# EAGLE design ble_bme690_node (EAGLE 9.6.2)

## Sheet 1 of 2
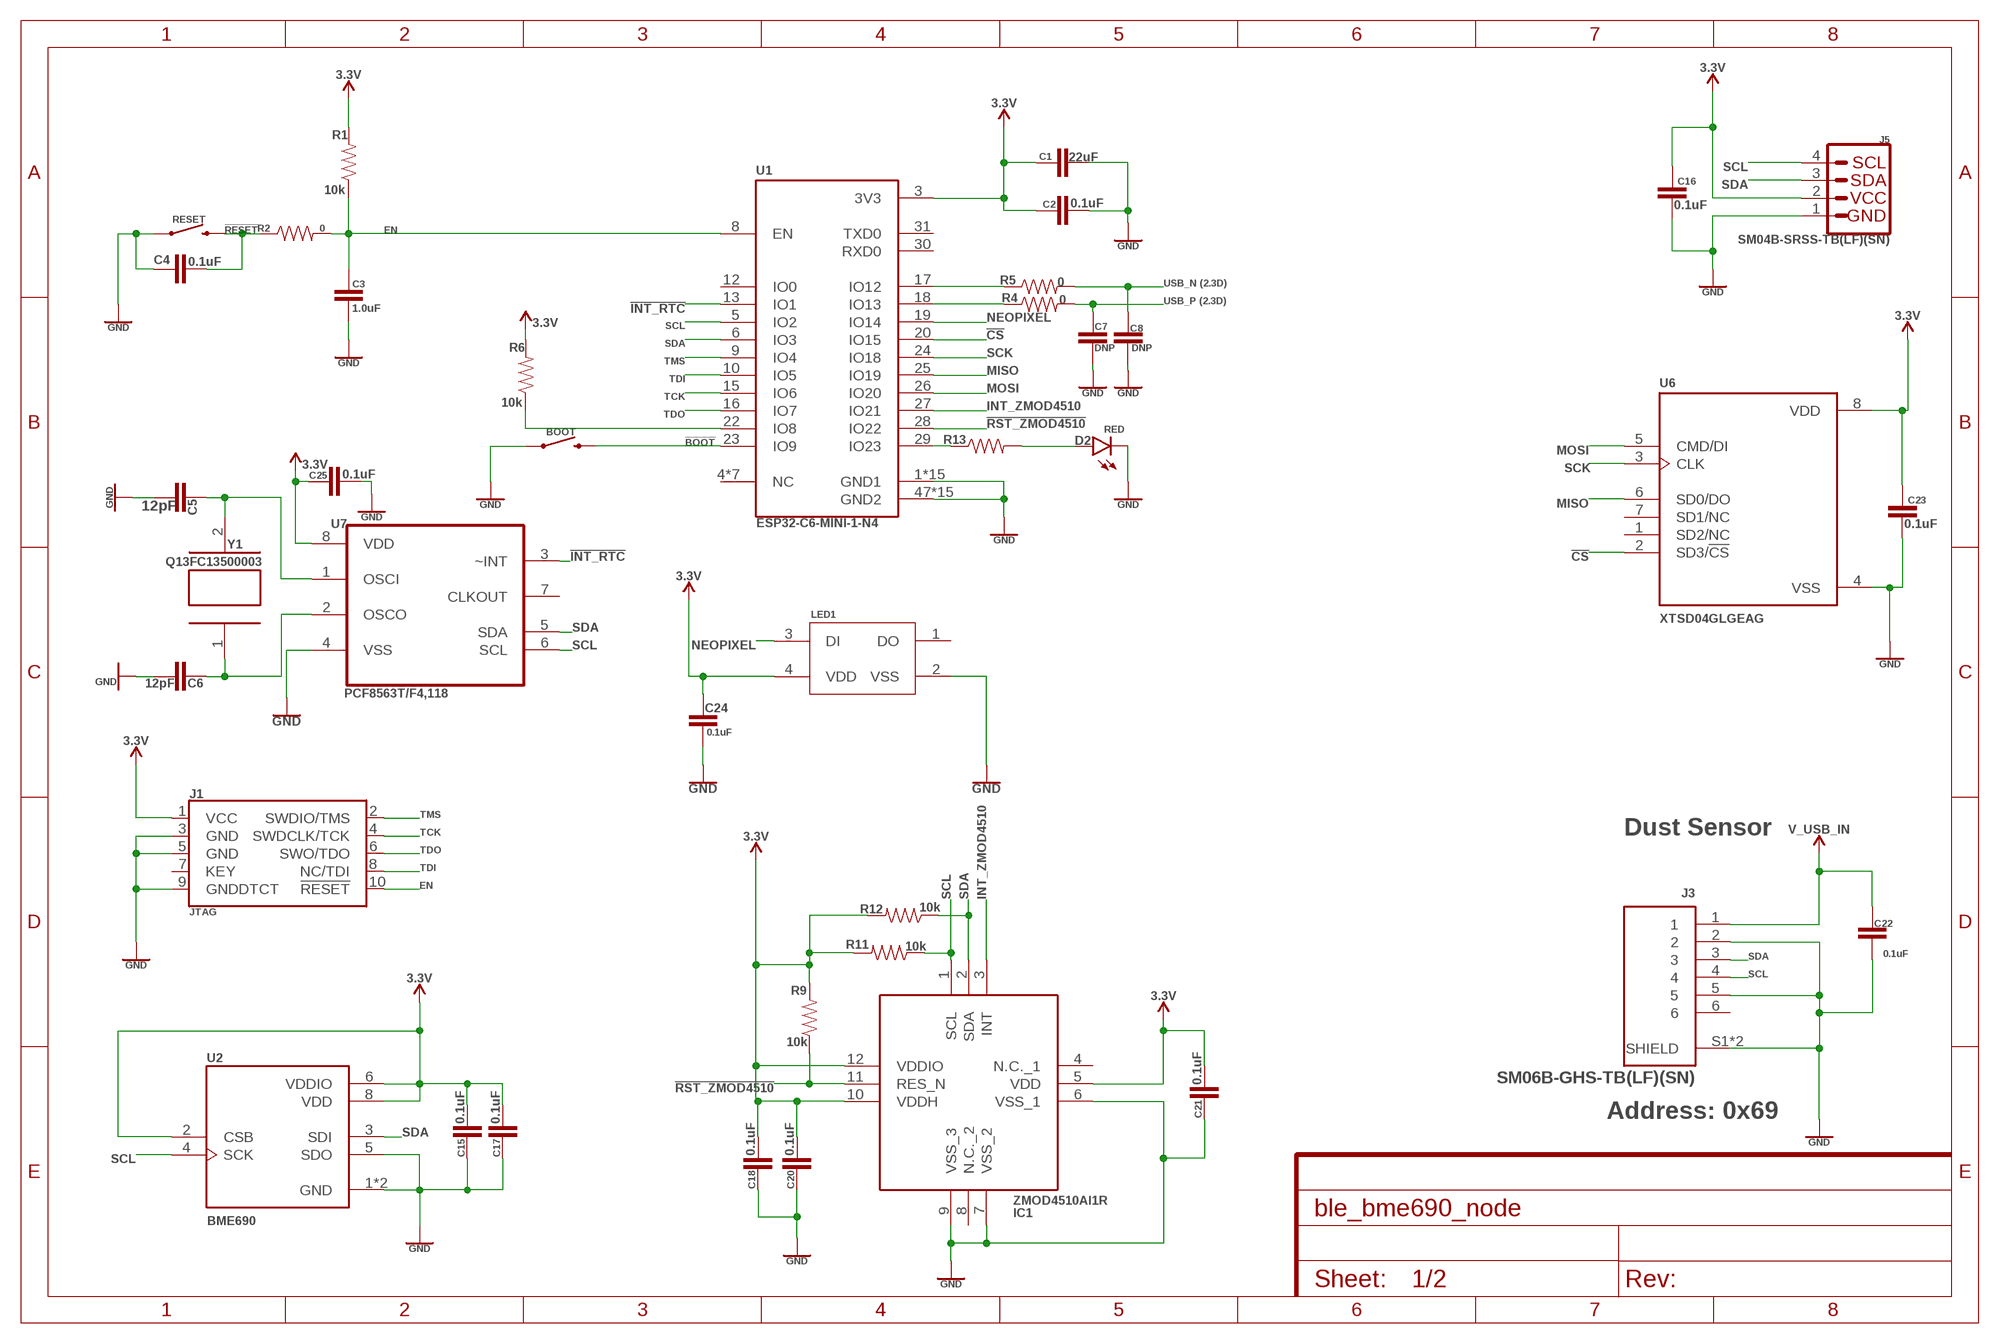
[diagram p0: schematic, sheet 1]

### Parts
BOOT  MOMENTARY-SWITCH-SPST-SMD-4.6X2.8MM  [TACTILE_SWITCH_SMD_4.6X2.8MM]
C1  22uF  22UF-0603-6.3V-20%  [0603]
C2  0.1uF  0.1UF-0402-6.3V-10%-X7R  [0402]
C3  1.0uF  1.0UF-0402-16V-10%  [0402]
C4  0.1uF  0.1UF-0402-6.3V-10%-X7R  [0402]
C5  12pF  12PF-0402-50V-5%  [0402]
C6  12pF  12PF-0402-50V-5%  [0402]
C7  DNP  0.1UF-0402-6.3V-10%-X7R  [0402]
C8  DNP  0.1UF-0402-6.3V-10%-X7R  [0402]
C15  0.1uF  0.1UF-0402-6.3V-10%-X7R  [0402]
C16  0.1uF  0.1UF-0402-6.3V-10%-X7R  [0402]
C17  0.1uF  0.1UF-0402-6.3V-10%-X7R  [0402]
C18  0.1uF  0.1UF-0402-6.3V-10%-X7R  [0402]
C20  0.1uF  0.1UF-0402-6.3V-10%-X7R  [0402]
C21  0.1uF  0.1UF-0402-6.3V-10%-X7R  [0402]
C22  0.1uF  0.1UF-0402-16V-10%  [0402]
C23  0.1uF  0.1UF-0402-6.3V-10%-X7R  [0402]
C24  0.1uF  0.1UF-0402-16V-10%  [0402]
C25  0.1uF  0.1UF-0402-6.3V-10%-X7R  [0402]
D2  RED  LED-RED0603  [LED-0603]
IC1  ZMOD4510AI1R  [ZMOD4510AI1R]
J1  JTAG  CORTEX_JTAG_DEBUG_SMD-UNSHROUDED  [2X5-SMD-UNSHROUDED]
J3  SM06B-GHS-TB(LF)(SN)  [JST_SM06B-GHS-TB(LF)(SN)]
J5  SM04B-SRSS-TB(LF)(SN)  QWIIC_CONNECTORJS-1MM  [1X04_1MM_RA]
LED1  WS2812B-2020  [WS2812B-2020]
R1  10k  10KOHM-0402-1/16W-1%  [0402]
R2  0  0OHM-0402-1/10W  [0402]
R4  0  0OHM-0402-1/10W  [0402]
R5  0  0OHM-0402-1/10W  [0402]
R6  10k  10KOHM-0402-1/16W-1%  [0402]
R9  10k  10KOHM-0402-1/16W-1%  [0402]
R11  10k  10KOHM-0402-1/16W-1%  [0402]
R12  10k  10KOHM-0402-1/16W-1%  [0402]
R13  100OHM  [0402]
RESET  MOMENTARY-SWITCH-SPST-SMD-4.6X2.8MM  [TACTILE_SWITCH_SMD_4.6X2.8MM]
U1  ESP32-C6-MINI-1-N4  [XCVR_ESP32-C6-MINI-1-N4]
U2  BME690  [IC_BME688]
U6  XTSD04GLGEAG  [SON127P600X800X95-8N]
U7  PCF8563T/F4,118  [SOIC127P600X175-8N]
Y1  Q13FC13500003  FC-135_32.7680KA-A0  [XTAL_FC-135_32.7680KA-A0]

### Nets
3.3V: C1.1 C2.1 C15.2 C16.2 C17.2 C18.2 C20.2 C21.2 C23.2 C24.1 C25.1 IC1.5(VDD) IC1.10(VDDH) IC1.12(VDDIO) J1.1(VCC) J5.2 LED1.4(VDD) R1.2 R6.2 R9.2 R11.2 R12.2 U1.3(3V3) U2.2(CSB) U2.6(VDDIO) U2.8(VDD) U6.8(VDD) U7.8(VDD) ; also sheet 2
!BOOT: BOOT.3 BOOT.4 U1.23(IO9)
!CS: U1.20(IO15) U6.2(SD3/!CS)
!INT_RTC: U1.13(IO1) U7.3(~INT)
!RESET: C4.2 R2.1 RESET.3 RESET.4
!RST_ZMOD4510: IC1.11(RES_N) R9.1 U1.28(IO22)
EN: C3.2 J1.10(!RESET) R1.1 R2.2 U1.8(EN)
GND: BOOT.1 BOOT.2 C1.2 C2.2 C3.1 C4.1 C5.2 C6.2 C7.2 C8.2 C15.1 C16.1 C17.1 C18.1 C20.1 C21.1 C22.2 C23.1 C24.2 C25.2 D2.C IC1.6(VSS_1) IC1.7(VSS_2) IC1.9(VSS_3) J1.3(GND) J1.5(GND) J1.9(GNDDTCT) J3.2 J3.5 J3.S1(SHIELD) J3.S2(SHIELD) J5.1 LED1.2(VSS) RESET.1 RESET.2 U1.1(GND1) U1.2(GND1) U1.11(GND1) U1.14(GND1) U1.36(GND1) U1.37(GND1) U1.38(GND1) U1.39(GND1) U1.40(GND1) U1.41(GND1) U1.42(GND1) U1.43(GND1) U1.44(GND1) U1.45(GND1) U1.46(GND1) U1.47(GND2) U1.48(GND2) U1.49_1(GND2) U1.49_2(GND2) U1.49_3(GND2) U1.49_4(GND2) U1.49_5(GND2) U1.49_6(GND2) U1.49_7(GND2) U1.49_8(GND2) U1.49_9(GND2) U1.50(GND2) U1.51(GND2) U1.52(GND2) U1.53(GND2) U2.1(GND) U2.5(SDO) U2.7(GND) U6.4(VSS) U7.4(VSS) ; also sheet 2
INT_ZMOD4510: IC1.3(INT) U1.27(IO21)
MISO: U1.25(IO19) U6.6(SD0/DO)
MOSI: U1.26(IO20) U6.5(CMD/DI)
N$1: R5.1 U1.17(IO12)
N$2: R4.1 U1.18(IO13)
N$3: R6.1 U1.22(IO8)
N$8: C5.1 U7.1(OSCI) Y1.2
N$11: R13.1 U1.29(IO23)
N$12: D2.A R13.2
NEOPIXEL: LED1.3(DI) U1.19(IO14)
RTC_IN: C6.1 U7.2(OSCO) Y1.1
SCK: U1.24(IO18) U6.3(CLK)
SCL: IC1.1(SCL) J3.4 J5.4 R11.1 U1.5(IO2) U2.4(SCK) U7.6(SCL)
SDA: IC1.2(SDA) J3.3 J5.3 R12.1 U1.6(IO3) U2.3(SDI) U7.5(SDA)
TCK: J1.4(SWDCLK/TCK) U1.15(IO6)
TDI: J1.8(NC/TDI) U1.10(IO5)
TDO: J1.6(SWO/TDO) U1.16(IO7)
TMS: J1.2(SWDIO/TMS) U1.9(IO4)
USB_N: C8.1 R5.2 ; also sheet 2
USB_P: C7.1 R4.2 ; also sheet 2
V_USB_2: C22.1 J3.1 ; supply symbol labelled V_USB_IN ; also sheet 2
Unconnected: IC1.4(N.C._1) IC1.8(N.C._2) J1.7(KEY) J3.6 LED1.1(DO) U1.4(NC) U1.7(NC) U1.12(IO0) U1.21(NC) U1.30(RXD0) U1.31(TXD0) U1.32(NC) U1.33(NC) U1.34(NC) U1.35(NC) U6.1(SD2/NC) U6.7(SD1/NC) U7.7(CLKOUT)

### Notes on the sheet
- Dust Sensor
- Address: 0x69

## Sheet 2 of 2
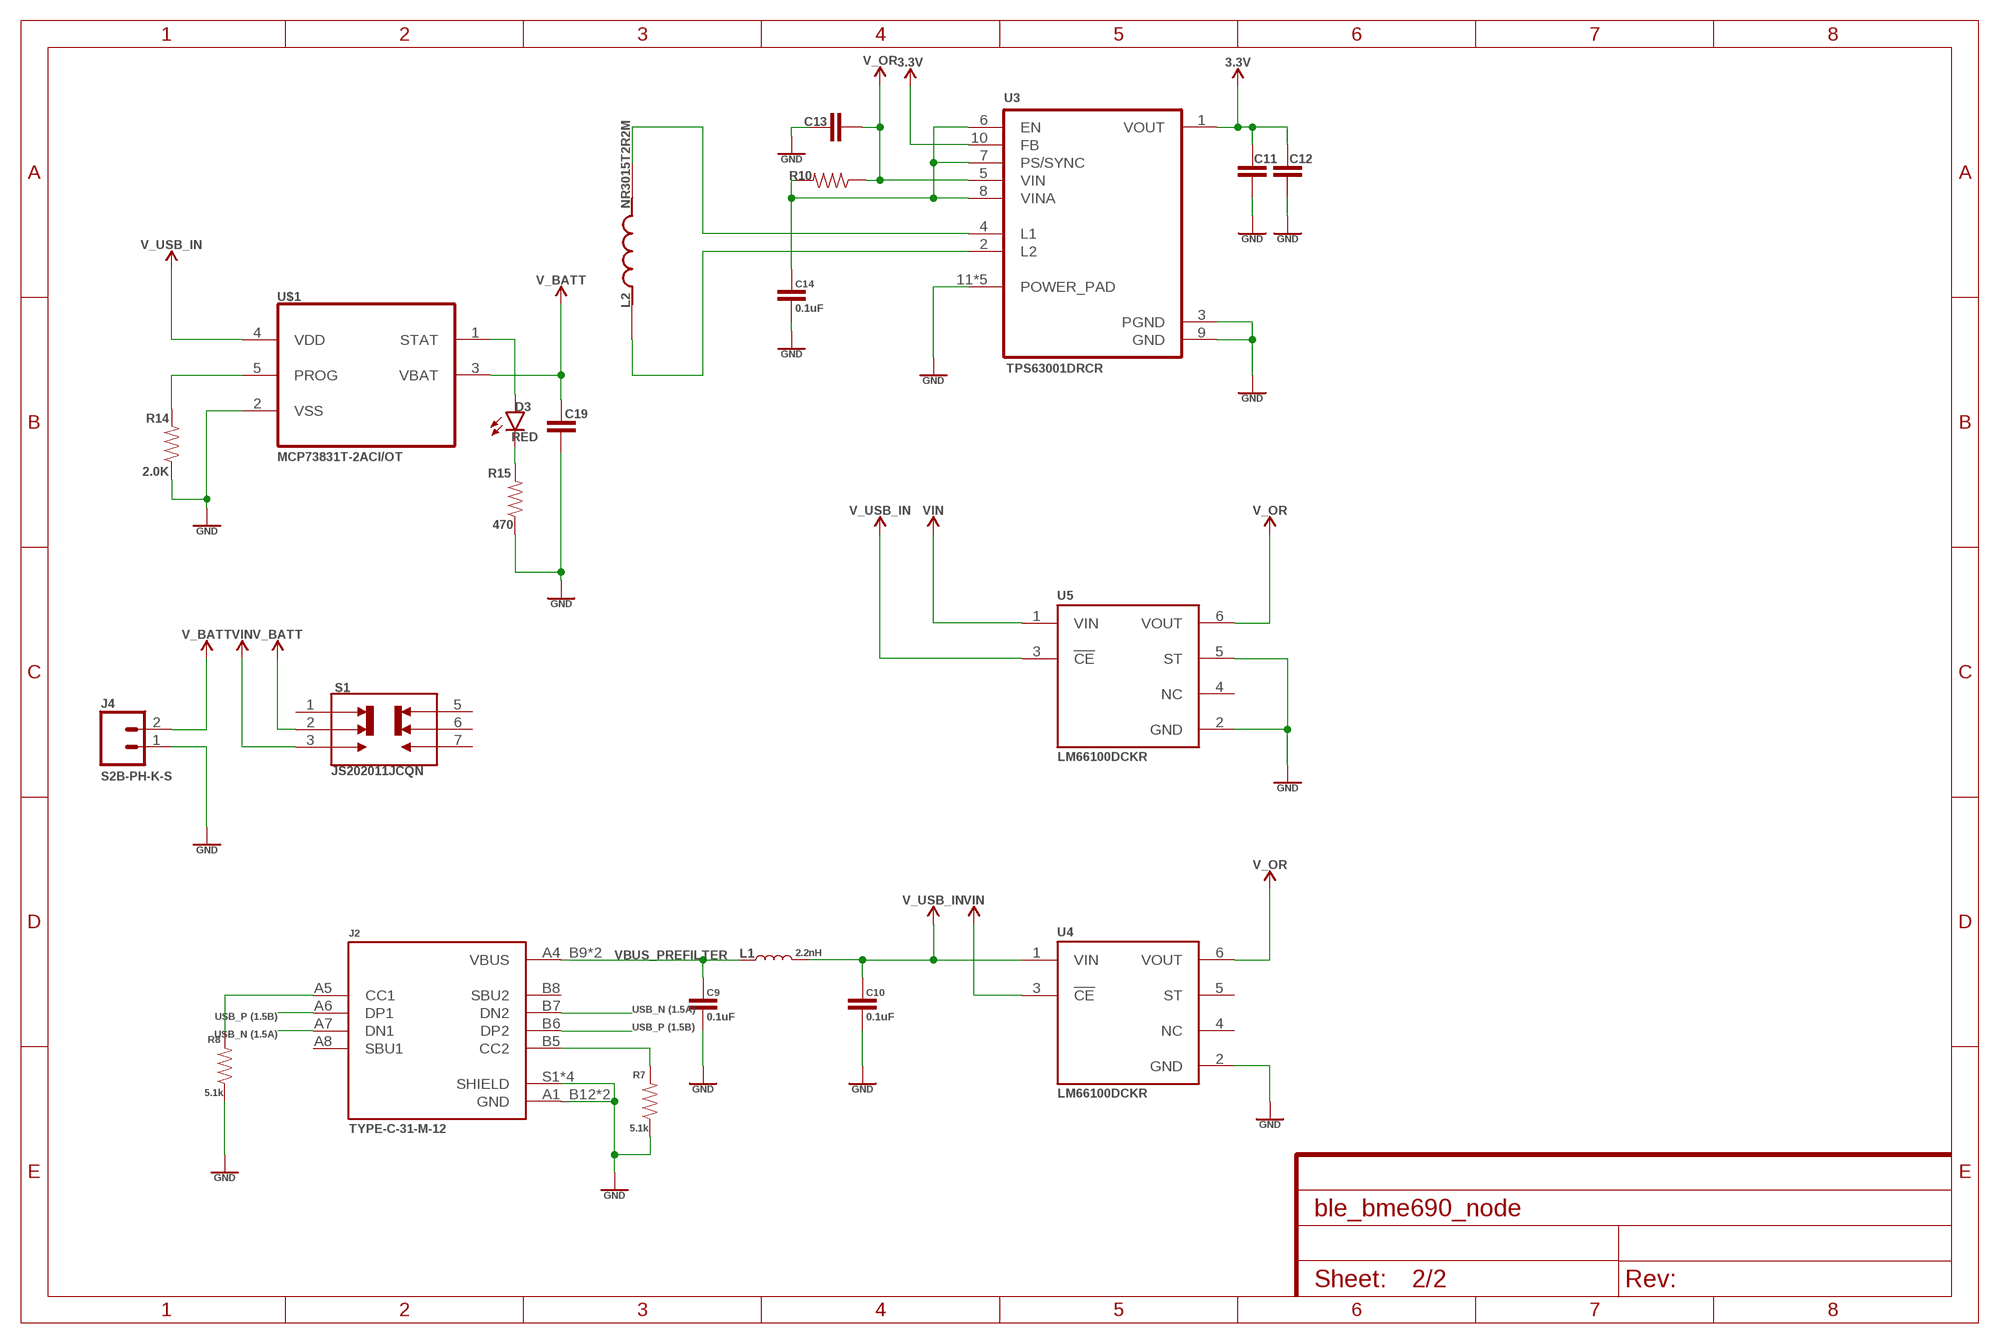
[diagram p1: schematic, sheet 2]

### Parts
C9  0.1uF  0.1UF-0402-6.3V-10%-X7R  [0402]
C10  0.1uF  0.1UF-0402-6.3V-10%-X7R  [0402]
C11  10UF0402  [0402]
C12  10UF0402  [0402]
C13  10UF0402  [0402]
C14  0.1uF  0.1UF-0402-6.3V-10%-X7R  [0402]
C19  4.7UF0402  [0402]
D3  RED  LED-RED0603  [LED-0603]
J2  TYPE-C-31-M-12  [HRO_TYPE-C-31-M-12]
J4  S2B-PH-K-S  CONN_02-JST-2-PTH-NO_SILK  [JST-2-PTH-NS]
L1  2.2nH  3.9NH  [0603]
L2  NR3015T2R2M  [IND_NR3015T2R2M]
R7  5.1k  5.1KOHM-0402-1/16W-1%  [0402]
R8  5.1k  5.1KOHM-0402-1/16W-1%  [0402]
R10  100OHM  [0402]
R14  2.0K  2.0KOHM-0402-1/16W-1%  [0402]
R15  470  470OHM-0402-1/16W-5%  [0402]
S1  JS202011JCQN  [SW_JS202011JCQN]
U3  TPS63001DRCR  [VREG_V62/16624-01YE]
U4  LM66100DCKR  [SOT65P210X110-6N]
U5  LM66100DCKR  [SOT65P210X110-6N]
U$1  MCP73831T-2ACI/OT  [SOT95P280X145-5N]

### Nets
3.3V: C11.1 C12.1 U3.1(VOUT) U3.10(FB) ; also sheet 1
GND: C9.1 C10.1 C11.2 C12.2 C13.1 C14.1 C19.2 J2.A1_B12(GND) J2.B1_A12(GND) J2.S1(SHIELD) J2.S2(SHIELD) J2.S3(SHIELD) J2.S4(SHIELD) J4.1 R7.1 R8.1 R14.1 R15.1 U3.3(PGND) U3.9(GND) U3.11(POWER_PAD) U3.12(POWER_PAD) U3.13(POWER_PAD) U3.14(POWER_PAD) U3.15(POWER_PAD) U4.2(GND) U5.2(GND) U5.5(ST) U$1.2(VSS) ; also sheet 1
N$4: J2.B5(CC2) R7.2
N$5: J2.A5(CC1) R8.2
N$6: L2.1 U3.2(L2)
N$9: L2.2 U3.4(L1)
N$10: C14.2 R10.2 U3.6(EN) U3.7(PS/SYNC) U3.8(VINA)
N$14: R14.2 U$1.5(PROG)
N$15: D3.A U$1.1(STAT)
N$16: D3.C R15.2
USB_N: J2.A7(DN1) J2.B7(DN2) ; also sheet 1
USB_P: J2.A6(DP1) J2.B6(DP2) ; also sheet 1
V_BATT: C19.1 J4.2 S1.2 U$1.3(VBAT)
V_USB_2: C10.2 L1.2 U4.1(VIN) U5.3(!CE) U$1.4(VDD) ; supply symbol labelled V_USB_IN ; also sheet 1
VBUS_PREFILTER: C9.2 J2.A4_B9(VBUS) J2.B4_A9(VBUS) L1.1
VIN: S1.3 U4.3(!CE) U5.1(VIN)
VREF1: C13.2 R10.1 U3.5(VIN) U4.6(VOUT) U5.6(VOUT) ; supply symbol labelled V_OR
Unconnected: J2.A8(SBU1) J2.B8(SBU2) S1.1 S1.5 S1.6 S1.7 U4.4(NC) U4.5(ST) U5.4(NC)

## Library data of the parts
BOOT RESET = SparkFun-Switches:MOMENTARY-SWITCH-SPST: Momentary Switch (Pushbutton) - SPST Normally-open (NO) SPST momentary switches (buttons, pushbuttons). Variants PTH-12MM - 12mm square, through-hole Momentary Pushbutton Switch - 12mm Square <https://www.sparkfun.com/products/9190> (COM-09190) PTH-6.0MM, PTH-6.0MM-KIT - 6.0mm square, through-hole Mini Pushbutton Switch <https://www.sparkfun.com/products/97> (COM-00097) KIT package intended for soldering kit's - only one side of pads' copper is exposed. PTH-RIGHT-ANGLE-KIT - Right-angle, through-hole Right Angle Tactile Button <https://www.sparkfun.com/products/10791> - Used on SparkFun BigTime Watch Kit <https://www.sparkfun.com/products/11734> SMD-12MM - 12mm square, surface-mount Tactile Button - SMD (12mm) <https://www.sparkfun.com/products/12993> (COM-12993) Used on SparkFun PicoBoard <https://www.sparkfun.com/products/11888> SMD-4.5MM - 4.5mm Square Trackball Switch Used on SparkFun Blackberry Trackballer Breakout <https://www.sparkfun.com/products/13169> SMD-4.6MMX2.8MM - 4.60mm x 2.80mm, surface mount Used on SparkFun Pro Micro - RP2040 <https://www.sparkfun.com/products/17717> SMD-5.2MM, SMD-5.2-REDUNDANT - 5.2mm square, surface-mount Mini Pushbutton Switch - SMD <https://www.sparkfun.com/products/8720> (COM-08720) Used on Arduino Pro Mini <https://www.sparkfun.com/products/11114> REDUNDANT package connects both switch circuits together SMD-6.0X3.5MM - 6.0 x 3.5mm, surface mount Momentary Reset Switch SMD <https://www.sparkfun.com/products/8229> (COM-08229) SMD-6.2MM-TALL - 6.2mm square, surface mount Tactile Button - SMD (6mm) <https://www.sparkfun.com/products/12992> Used on SparkFun Digital Sandbox <https://www.sparkfun.com/products/12651> SMD-RIGHT-ANGLE - Right-angle, surface mount Used on SparkFun Block for Intel® Edison - Arduino <https://www.sparkfun.com/products/13036>; PROD_ID: SWCH-15606
C1 = SparkFun-Capacitors:22UF: 22µF ceramic capacitors A capacitor is a passive two-terminal electrical component used to store electrical energy temporarily in an electric field.; PROD_ID: CAP-14464
C2 C4 C9 C10 C14-C18 C20 C21 C23 C25 = SparkFun-Capacitors_Sai:0.1UF: 0.1µF ceramic capacitors A capacitor is a passive two-terminal electrical component used to store electrical energy temporarily in an electric field.; PROD_ID: CAP-14993
C3 = SparkFun-Capacitors_Sai:1.0UF: 1µF ceramic capacitors A capacitor is a passive two-terminal electrical component used to store electrical energy temporarily in an electric field.; PROD_ID: CAP-12417
C5 C6 = SparkFun-Capacitors_Sai:12PF: 12pF ceramic capacitors A capacitor is a passive two-terminal electrical component used to store electrical energy temporarily in an electric field.; PROD_ID: CAP-14665
C7 C8 = SparkFun-Capacitors:0.1UF: 0.1µF ceramic capacitors A capacitor is a passive two-terminal electrical component used to store electrical energy temporarily in an electric field.; PROD_ID: CAP-14993; VALUE: 0.1uF
C11-C13 = SparkFun-Capacitors_Sai:10UF: 10.0µF ceramic capacitors A capacitor is a passive two-terminal electrical component used to store electrical energy temporarily in an electric field.
C19 = SparkFun-Capacitors_Sai:4.7UF: 4.7µF ceramic capacitors A capacitor is a passive two-terminal electrical component used to store electrical energy temporarily in an electric field.
C22 C24 = SparkFun-Capacitors:0.1UF: 0.1µF ceramic capacitors A capacitor is a passive two-terminal electrical component used to store electrical energy temporarily in an electric field.; PROD_ID: CAP-12416
D2 D3 = SparkFun-LED:LED-RED: Red SMD LED Used in manufacturing of most products at SparkFun Packages: 0603 - KB - KingBright (DIO-17976) SMD 0603 package [Datasheet] <https://www.kingbrightusa.com/images/catalog/SPEC/APT1608SURCK.pdf> 0603 - (DIO-00819, has gone EOL) SMD 0603 package 0603 SMART - SMD 0603 SMART package ( more efficient and expensive)[Product Link] <http://www.osram-os.com/Graphics/XPic2/00077099_0.pdf> 1206 - SMD1206 package [Product Link] <https://www.sparkfun.com/datasheets/DevTools/LilyPad/Q150OVS4.pdff> SparkFun Products: Pro Mini 328 -5V <https://www.sparkfun.com/products/821> RedBoard <https://www.sparkfun.com/products/12757> IOIO-OTG <https://www.sparkfun.com/products/13613>; PROD_ID: DIO-00819
IC1 = ZMOD4510AI1R:ZMOD4510AI1R: Air Quality Sensors ZMOD4510AI1 GASSENSOR Source: Datasheet <https://www.renesas.com/sg/en/document/dst/zmod4510-datasheet?r=463746>; DESCRIPTION: Air Quality Sensors ZMOD4510AI1 GASSENSOR; HEIGHT: 0.77mm; MANUFACTURER_NAME: Renesas Electronics; MANUFACTURER_PART_NUMBER: ZMOD4510AI1R; MOUSER_PART_NUMBER: 972-ZMOD4510AI1R; MOUSER_PRICE-STOCK: https://www.mouser.co.uk/ProductDetail/Renesas-Electronics/ZMOD4510AI1R?qs=vLWxofP3U2zud2ED7A7kKg%3D%3D
J1 = SparkFun-Connectors:CORTEX_JTAG_DEBUG: Cortex Debug Connector - 10 pin Supports JTAG debug, Serial Wire debug, and Serial Wire Viewer. PTH and SMD connector options available. General Connector Information <http://infocenter.arm.com/help/topic/com.arm.doc.faqs/attached/13634/cortex_debug_connectors.pdf> Products: PTH Connector <http://www.digikey.com/product-detail/en/cnc-tech/3220-10-0100-00/1175-1627-ND/3883661> -via Digi-Key SparkFun PSoc <https://www.sparkfun.com/products/13229> SparkFun T <https://www.sparkfun.com/products/13810>; PROD_ID: CONN-15353
J2 = TYPE-C-31-M-12:TYPE-C-31-M-12: Check availability <https://pricing.snapeda.com/parts/TYPE-C-31-M-12/HRO%20Electronics%20Co.%2C%20Ltd./view-part?ref=eda>; AVAILABILITY: Not in stock; DESCRIPTION: USB Connectors 24 Receptacle 1 8.94*7.3mm RoHS; MF: HRO Electronics Co., Ltd.; MP: TYPE-C-31-M-12; PACKAGE: Package; PRICE: None
J3 = SM06B-GHS-TB_LF__SN_:SM06B-GHS-TB(LF)(SN): GHS Series 1.25 mm Pitch Disc. Crimp Wire-to-Wire Connector Check availability <https://pricing.snapeda.com/parts/SM06B-GHS-TB%28LF%29%28SN%29/JST%20Sales%20America%20Inc./view-part?ref=eda>; AVAILABILITY: In Stock; CHECK_PRICES: https://www.snapeda.com/parts/SM06B-GHS-TB(LF)(SN)/JST/view-part/?ref=eda; DESCRIPTION: Connector Header Surface Mount, Right Angle 6 position 0.049 (1.25mm); MF: JST Sales America Inc.; MP: SM06B-GHS-TB(LF)(SN); PACKAGE: None; PRICE: None; SNAPEDA_LINK: https://www.snapeda.com/parts/SM06B-GHS-TB(LF)(SN)/JST/view-part/?ref=snap
J4 = SparkFun-Connectors:CONN_02: Multi connection point. Often used as Generic Header-pin footprint for 0.1 inch spaced/style header connections On any of the 0.1 inch spaced packages, you can populate with these: Break Away Headers - Straight <https://www.sparkfun.com/products/116> (PRT-00116) Break Away Male Headers - Right Angle <https://www.sparkfun.com/products/553> (PRT-00553) Female Headers <https://www.sparkfun.com/products/115> (PRT-00115) Break Away Headers - Machine Pin <https://www.sparkfun.com/products/117> (PRT-00117) Break Away Female Headers - Swiss Machine Pin <https://www.sparkfun.com/products/743> (PRT-00743) For SCREWTERMINALS and SPRING TERMINALS visit here: Screw Terimnals on SparkFun.com <https://www.sparkfun.com/search/results?term=Screw+Terminals> (5mm/3.5mm/2.54mm spacing) This device is also useful as a general connection point to wire up your design to another part of your project. Our various solder wires solder well into these plated through hole pads. Hook-Up Wire - Assortment (Stranded, 22 AWG) <https://www.sparkfun.com/products/11375> (PRT-11375) Hook-Up Wire - Assortment (Solid Core, 22 AWG) <https://www.sparkfun.com/products/11367> (PRT-11367) View the entire wire category on our website here <https://www.sparkfun.com/categories/141> Special notes: Molex polarized connector foot print use with: PRT-08233 with associated crimp pins and housings. 2.54_SCREWTERM for use with PRT-10571. 3.5mm Screw Terminal footprints for PRT-08084 5mm Screw Terminal footprints for use with PRT-08432
J5 = SparkFun-Connectors:QWIIC_CONNECTOR: SparkFun I2C Standard Qwiic Connector An SMD 1mm pitch JST connector makes it easy and quick (get it? Qwiic?) to connect I2C devices to each other. The Qwiic system <http://www.sparkfun.com/qwiic> enables fast and solderless connection between popular platforms and various sensors and actuators. We carry 200mm <https://www.sparkfun.com/products/14204>, 100mm <https://www.sparkfun.com/products/14205>, 50mm <https://www.sparkfun.com/products/14206>, and breadboard friendly <https://www.sparkfun.com/products/14207> Qwiic cables. We also offer 10 pcs strips <https://www.sparkfun.com/products/14323> the SMD connectors.; PROD_ID: CONN-13694
L1 = SparkFun-Coils:3.9NH; PROD_ID: NDUC-08761
L2 = NR3015T2R2M:NR3015T2R2M: Check availability <https://pricing.snapeda.com/parts/NR3015T2R2M/Taiyo%20Yuden/view-part?ref=eda>; AVAILABILITY: In Stock; CHECK_PRICES: https://www.snapeda.com/parts/NR3015T2R2M/Taiyo+Yuden/view-part/?ref=eda; DESCRIPTION: 2.2 µH Shielded Drum Core, Wirewound Inductor 1.5 A 72mOhm Max Nonstandard; MF: Taiyo Yuden; MP: NR3015T2R2M; PACKAGE: Non standard Taiyo Yuden; PRICE: None; SNAPEDA_LINK: https://www.snapeda.com/parts/NR3015T2R2M/Taiyo+Yuden/view-part/?ref=snap
LED1 = WS2812B-2020:WS2812B-2020: A small 2x2mm addressable RGB led Check availability <https://pricing.snapeda.com/parts/WS2812B-2020/WorldSemi/view-part?ref=eda>; AVAILABILITY: Not in stock; DESCRIPTION: Programmable LED; SMD; 2020; RGB; 2x2x0.84mm; 3.7÷5.3V; 2kHz; MF: WorldSemi; MP: WS2812B-2020; PACKAGE: None; PRICE: None
R1 R6 R9 R11 R12 = SparkFun-Resistors_Sai:10KOHM: 10kΩ resistor A resistor is a passive two-terminal electrical component that implements electrical resistance as a circuit element. Resistors act to reduce current flow, and, at the same time, act to lower voltage levels within circuits. - Wikipedia; PROD_ID: RES-14241
R2 R4 R5 = SparkFun-Resistors_Sai:0OHM: 0Ω resistor A resistor is a passive two-terminal electrical component that implements electrical resistance as a circuit element. Resistors act to reduce current flow, and, at the same time, act to lower voltage levels within circuits. - Wikipedia; PROD_ID: RES-14244
R7 R8 = SparkFun-Resistors_Sai:5.1KOHM; PROD_ID: RES-14340
R10 R13 = SparkFun-Resistors_Sai:100OHM: 100Ω resistor A resistor is a passive two-terminal electrical component that implements electrical resistance as a circuit element. Resistors act to reduce current flow, and, at the same time, act to lower voltage levels within circuits. - Wikipedia
R14 = SparkFun-Resistors_Sai:2.0KOHM: 2kΩ resistor A resistor is a passive two-terminal electrical component that implements electrical resistance as a circuit element. Resistors act to reduce current flow, and, at the same time, act to lower voltage levels within circuits. - Wikipedia; PROD_ID: RES-15406
R15 = SparkFun-Resistors_Sai:470OHM: 470Ω resistor A resistor is a passive two-terminal electrical component that implements electrical resistance as a circuit element. Resistors act to reduce current flow, and, at the same time, act to lower voltage levels within circuits. - Wikipedia; PROD_ID: RES-13829
S1 = JS202011JCQN:JS202011JCQN: Slide Switch DPDT Surface Mount Check availability <https://pricing.snapeda.com/parts/JS202011JCQN/C%26K/view-part?ref=eda>; AVAILABILITY: In Stock; CHECK_PRICES: https://www.snapeda.com/parts/JS202011JCQN/C%2526K/view-part/?ref=eda; DESCRIPTION: Slide Switch DPDT Surface Mount; MF: C&K; MP: JS202011JCQN; PACKAGE: DPDT-6 C&amp;K; PRICE: None; SNAPEDA_LINK: https://www.snapeda.com/parts/JS202011JCQN/C%2526K/view-part/?ref=snap
U1 = ESP32-C6-MINI-1-N4:ESP32-C6-MINI-1-N4: Check availability <https://pricing.snapeda.com/parts/ESP32-C6-MINI-1-N4/Espressif%20Systems/view-part?ref=eda>; AVAILABILITY: In Stock; CHECK_PRICES: https://www.snapeda.com/parts/ESP32-C6-MINI-1-N4/Espressif+Systems/view-part/?ref=eda; DESCRIPTION: 802.15.4, Bluetooth, WiFi 802.11ax, Bluetooth v5.0, Zigbee® Transceiver Module 2.4GHz Antenna Not Included Surface Mount; MF: Espressif Systems; MP: ESP32-C6-MINI-1-N4; PACKAGE: SMD-53 Espressif Systems; PRICE: None; SNAPEDA_LINK: https://www.snapeda.com/parts/ESP32-C6-MINI-1-N4/Espressif+Systems/view-part/?ref=snap
U2 = BME690:BME690: Gas sensor measuring relative humidity, barometric pressure, ambient temperature and gas (VOC) Check availability <https://pricing.snapeda.com/parts/BME688/Bosch%20Sensortec/view-part?ref=eda>; AVAILABILITY: In Stock; DESCRIPTION: Gas sensor measuring relative humidity, barometric pressure, ambient temperature and gas (VOC); MF: Bosch Sensortec; MP: BME688; PACKAGE: None; PRICE: None; PURCHASE-URL: https://pricing.snapeda.com/search/part/BME688/?ref=eda
U3 = TPS63001DRCR:TPS63001DRCR: Check availability <https://pricing.snapeda.com/parts/TPS63001DRCR/Texas%20Instruments/view-part?ref=eda>; AVAILABILITY: In Stock; CHECK_PRICES: https://www.snapeda.com/parts/TPS63001DRCR/Texas+Instruments/view-part/?ref=eda; DESCRIPTION: 96% Buck-Boost Converter with 1.7A Current Switches, 3.3V fixed Output voltage in 3x3 QFN; MF: Texas Instruments; MP: TPS63001DRCR; PACKAGE: VSON-10 Texas Instruments; PRICE: None; SNAPEDA_LINK: https://www.snapeda.com/parts/TPS63001DRCR/Texas+Instruments/view-part/?ref=snap
U4 U5 = LM66100DCKR:LM66100DCKR: 6-V, Low IQ ideal diode with input polarity protection 6-SC70 -40 to 105 Check availability <https://pricing.snapeda.com/parts/LM66100DCKR/Texas%20Instruments/view-part?ref=eda>; AVAILABILITY: In Stock; CHECK_PRICES: https://www.snapeda.com/parts/LM66100DCKR/Texas+Instruments/view-part/?ref=eda; DESCRIPTION: 1.5-V to 5.5-V, 1.5-A, 0.5-µA IQ ideal diode with integrated FET; MF: Texas Instruments; MP: LM66100DCKR; PACKAGE: SOT-SC70-6 Texas Instruments; PRICE: None; SNAPEDA_LINK: https://www.snapeda.com/parts/LM66100DCKR/Texas+Instruments/view-part/?ref=snap
U6 = XTSD04GLGEAG:XTSD04GLGEAG: Check availability <https://pricing.snapeda.com/parts/XTSD04GLGEAG/XTX/view-part?ref=eda>; AVAILABILITY: Not in stock; CHECK_PRICES: https://www.snapeda.com/parts/XTSD04GLGEAG/XTX/view-part/?ref=eda; DESCRIPTION: Flash Memory Card 4Gbit 2.7V to 3.6V SD Card 8-Pin LGA; MF: XTX; MP: XTSD04GLGEAG; PACKAGE: Package; PRICE: None; SNAPEDA_LINK: https://www.snapeda.com/parts/XTSD04GLGEAG/XTX/view-part/?ref=snap
U7 = PCF8563T_F4_118:PCF8563T/F4,118: Real-time clock/calendar Check availability <https://pricing.snapeda.com/parts/PCF8563T/F4%2C118/NXP%20USA/view-part?ref=eda>; AVAILABILITY: In Stock; CHECK_PRICES: https://www.snapeda.com/parts/PCF8563T/F4,118/NXP+Semiconductors/view-part/?ref=eda; DESCRIPTION: Real Time Clock (RTC) IC Clock/Calendar - I²C, 2-Wire Serial 8-SOIC (0.154, 3.90mm Width); MF: NXP USA; MP: PCF8563T/F4,118; PACKAGE: SOIC-8 NXP Semiconductors; PRICE: None; SNAPEDA_LINK: https://www.snapeda.com/parts/PCF8563T/F4,118/NXP+Semiconductors/view-part/?ref=snap
U$1 = MCP73831T-2ACI_OT:MCP73831T-2ACI/OT: Charge Management Controller Check availability <https://pricing.snapeda.com/parts/MCP73831T-2ACI/OT/Microchip/view-part?ref=eda>; AVAILABILITY: In Stock; CHECK_PRICES: https://www.snapeda.com/parts/MCP73831T-2ACI/OT/Microchip/view-part/?ref=eda; DESCRIPTION: TINY INTEGRATED LI-ION/LI-POLY CHARGE MGNT CONTROLLER, 4.2V VREG | Microchip Technology Inc. MCP73831T-2ACI/OT; MF: Microchip; MP: MCP73831T-2ACI/OT; PACKAGE: SOT-23 Microchip; PRICE: None; SNAPEDA_LINK: https://www.snapeda.com/parts/MCP73831T-2ACI/OT/Microchip/view-part/?ref=snap
Y1 = FC-135_32.7680KA-A0:FC-135_32.7680KA-A0: None Check availability <https://pricing.snapeda.com/parts/FC-135%2032.7680KA-A0/EPSON/view-part?ref=eda>; AVAILABILITY: In Stock; DESCRIPTION: 32.768 kHz ±20ppm Crystal 12.5pF 70 kOhms 2-SMD, No Lead; MF: EPSON; MP: FC-135 32.7680KA-A0; PACKAGE: SMD-2 Epson; PRICE: None; PURCHASE-URL: https://pricing.snapeda.com/search/part/FC-135 32.7680KA-A0/?ref=eda

## Board
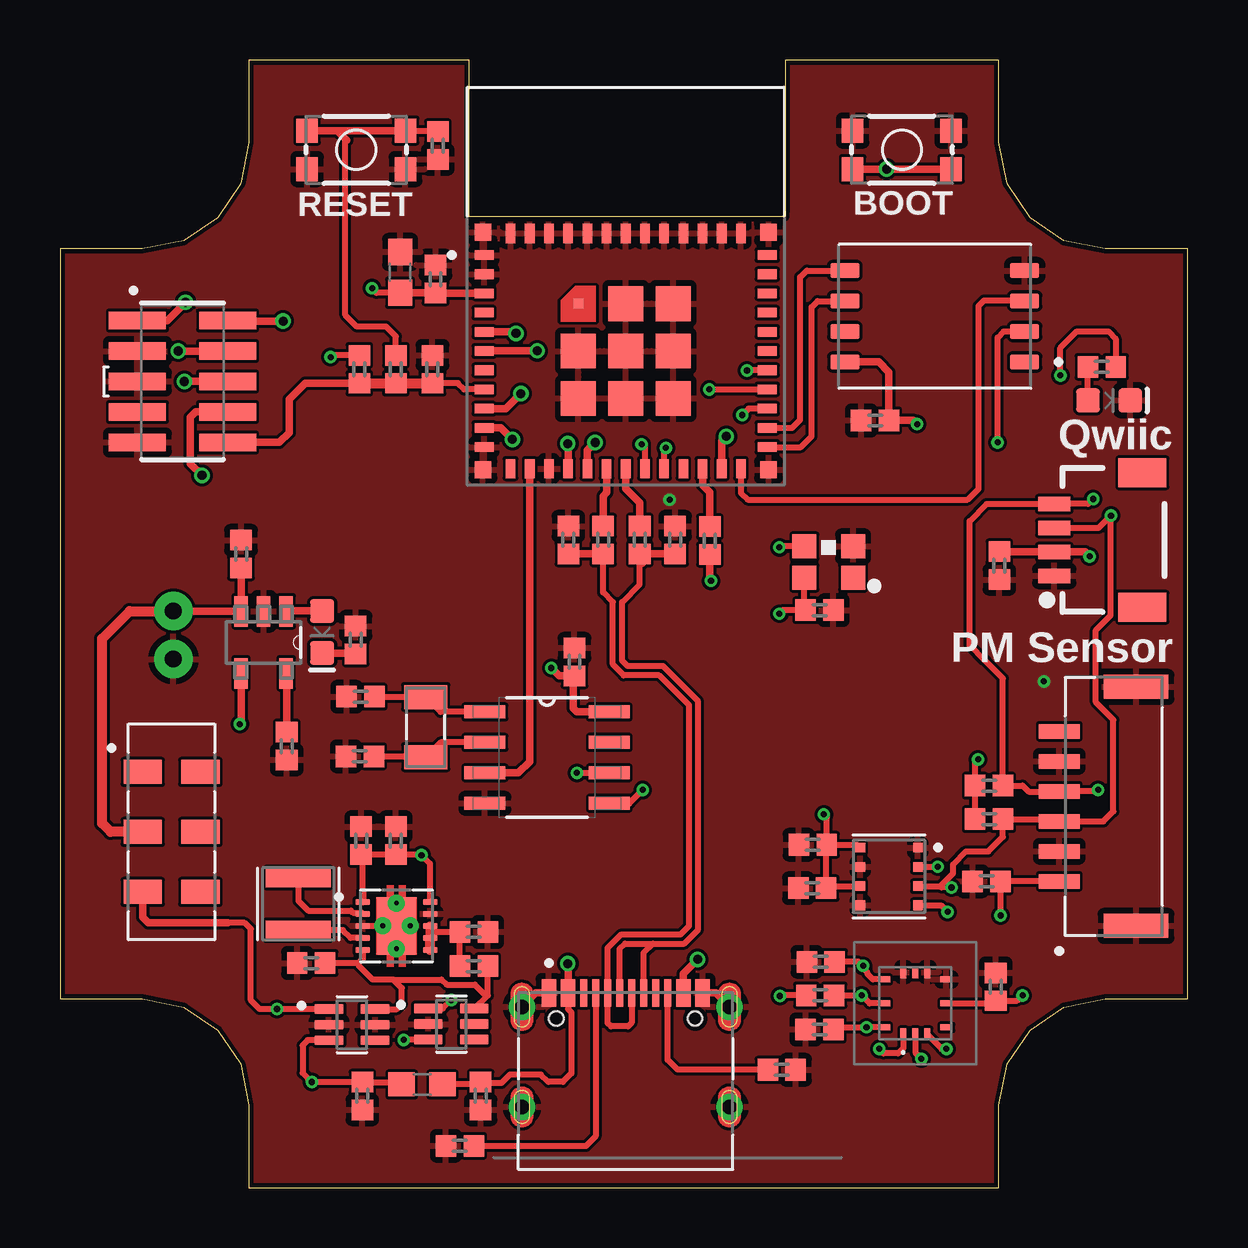
[diagram p2: board, top side]
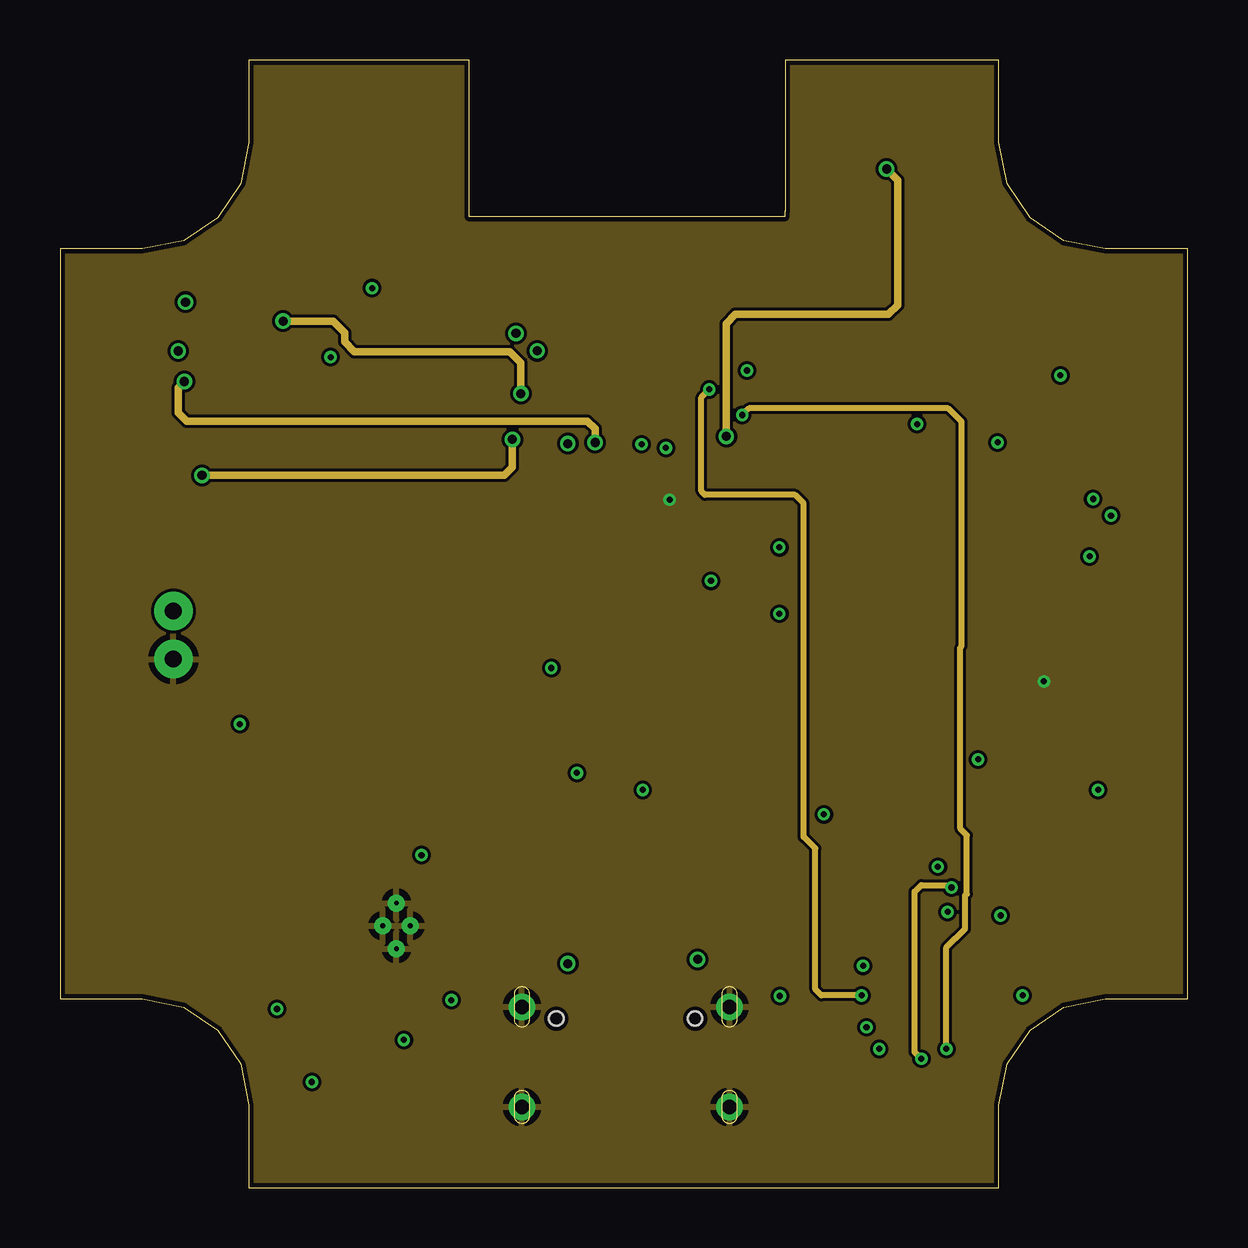
[diagram p3: board, inner layer Route2]
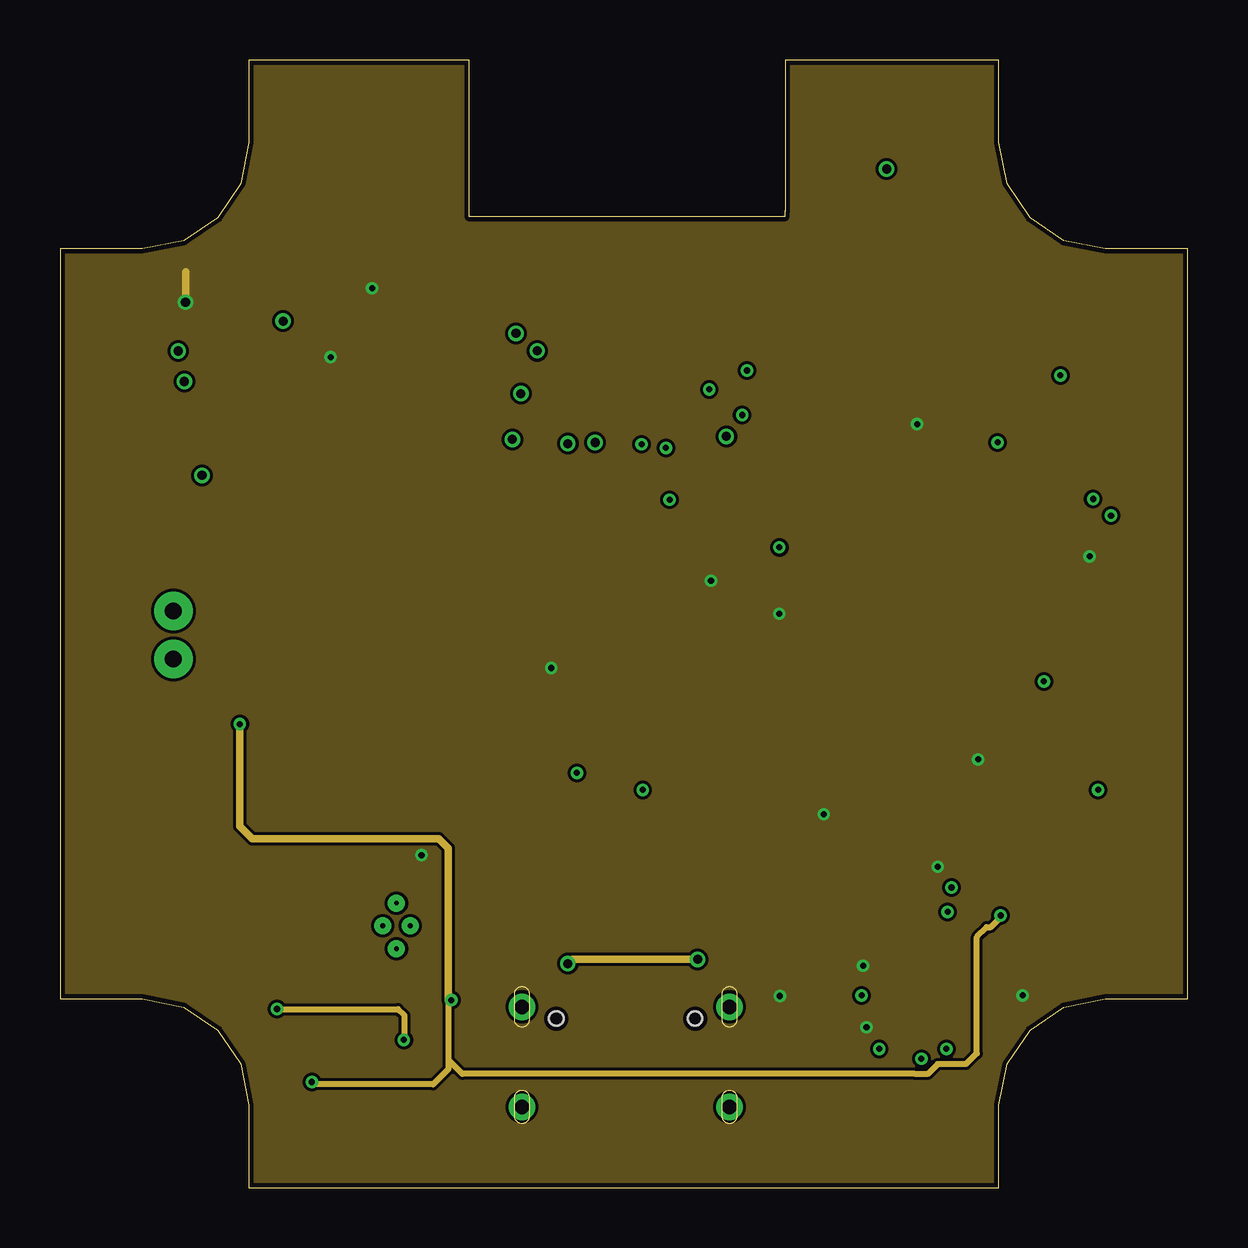
[diagram p4: board, inner layer Route15]
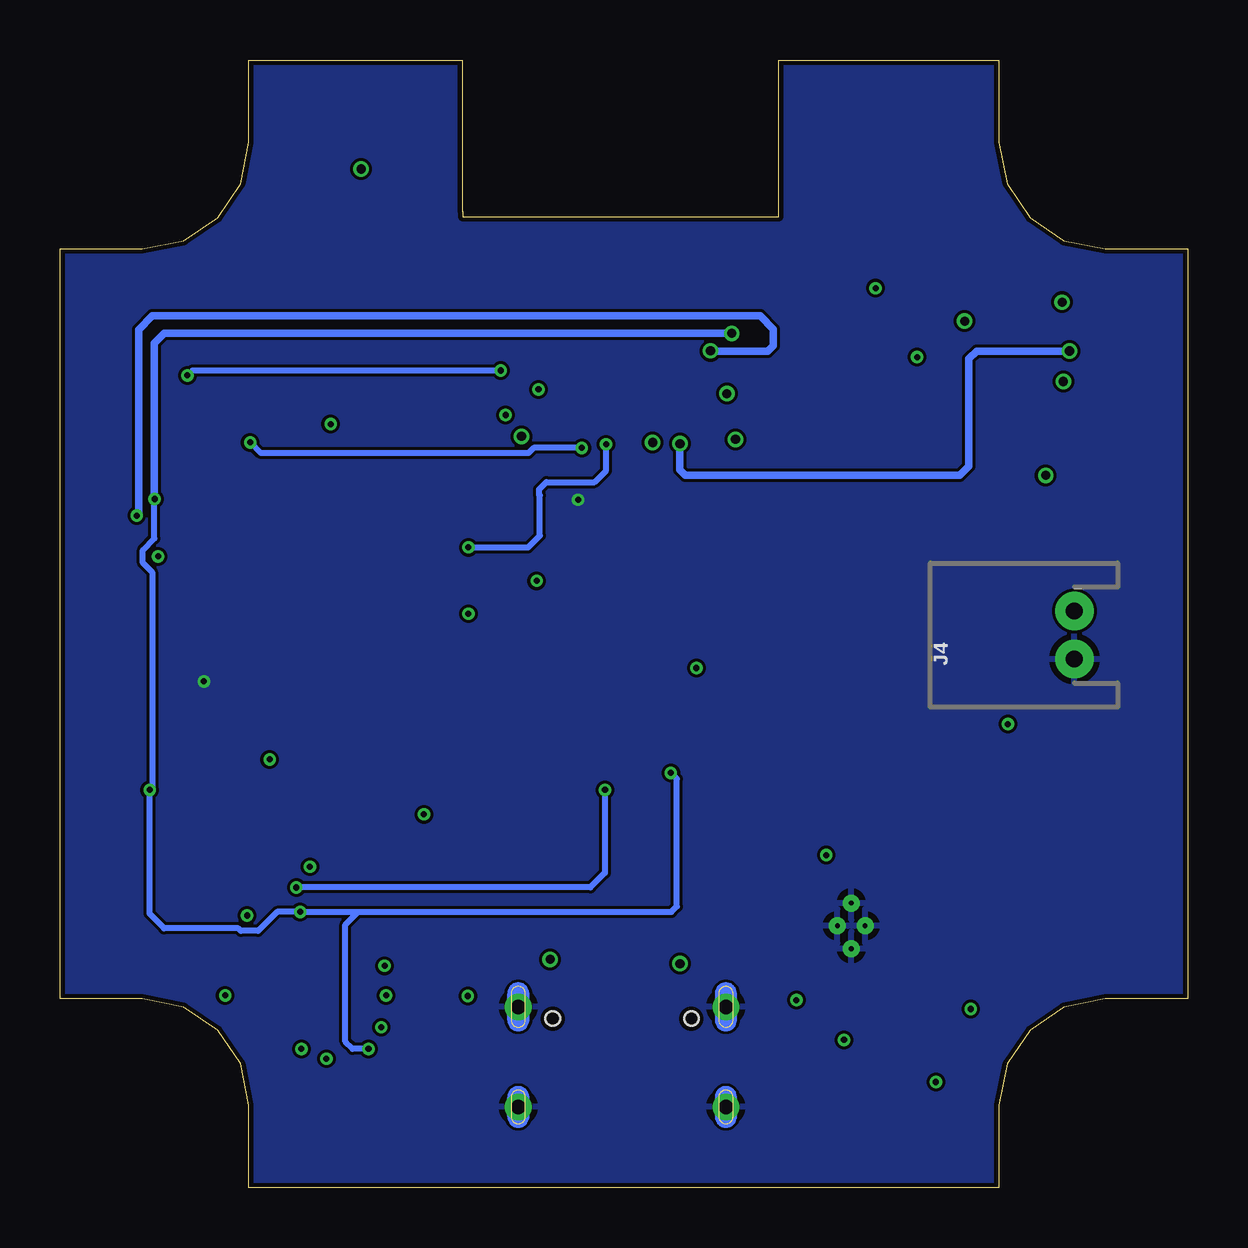
[diagram p5: board, bottom side, seen from below]

Size 46.99 x 46.99 mm. Coordinates in mm from the lower left corner, seen from the top.
Outline: 46.99,7.87 46.99,39.12 43.56,39.12 41.83,39.46 40.42,40.42 39.47,41.83 39.12,43.56 39.12,46.99 30.23,46.99 30.23,40.68 30.2,40.68 30.2,40.45 17.04,40.45 17.04,46.99 7.87,46.99 7.87,43.56 7.53,41.83 6.57,40.42 5.16,39.46 3.43,39.12 0,39.12 0,7.87 3.43,7.87 5.16,7.52 6.57,6.57 7.53,5.16 7.87,3.43 7.87,0 39.12,0 39.12,3.43 39.47,5.16 40.42,6.57 41.83,7.52 43.56,7.87 46.99,7.87
Copper layers (1+2*15+16): Top 0.035mm / dielectric 0.2mm / Route2 0.0175mm / dielectric 1.065mm / Route15 0.0175mm / dielectric 0.2mm / Bottom 0.035mm
Design rules "jlcpcb-4layers": minimum track width 3.5mil, minimum drill 0.2mm, track to track 5mil, track to pad 0.2mm, pad to pad 5mil, via to via 0.5mm, smd to smd 5mil, copper to edge 0.2mm, drill to drill 6mil, minimum pad ring 10mil, minimum via ring 0.13mm, stop-mask expansion 0.05mm, vias tented up to drill 16mil, thermal gap 10mil

### Footprints (pad centres in the part's own frame; a part is rotated, then mirrored left to right if it is on the bottom)
TACTILE_SWITCH_SMD_4.6X2.8MM = smd 0.9 x 1: 1 -2.05,-0.8; 2 2.05,-0.8; 3 2.05,0.8; 4 -2.05,0.8
0603 = smd 1.1 x 1: 1 -0.85,0; 2 0.85,0
0402 = smd 0.85 x 0.9: 1 -0.58,0; 2 0.58,0
LED-0603 = smd 1 x 1: A -0.877,0; C 0.877,0
ZMOD4510AI1R = smd 0.25 x 0.5: 1 -0.5,-1.3; 2 0,-1.3; 3 0.5,-1.3; 7 0.5,1.3; 8 0,1.3; 9 -0.5,1.3 | smd 0.5 x 0.25: 4 1.3,-1; 5 1.3,0; 6 1.3,1; 10 -1.3,1; 11 -1.3,0; 12 -1.3,-1
2X5-SMD-UNSHROUDED = smd 0.74 x 2.38: 1 -2.54,-1.88; 2 -2.54,1.88; 3 -1.27,-1.88; 4 -1.27,1.88; 5 0,-1.88; 6 0,1.88; 7 1.27,-1.88; 8 1.27,1.88; 9 2.54,-1.88; 10 2.54,1.88
HRO_TYPE-C-31-M-12 = smd 0.6 x 1.14: A1_B12 -3.2,4.75; A4_B9 -2.4,4.75; B1_A12 3.2,4.75; B4_A9 2.4,4.75 | smd 0.3 x 1.14: A5 -1.25,4.75; A6 -0.25,4.75; A7 0.25,4.75; A8 1.25,4.75; B5 1.75,4.75; B6 0.75,4.75; B7 -0.75,4.75; B8 -1.75,4.75 | drill 0.6 pad 0.9: S1 -4.325,4.17; S2 4.325,4.17; S3 -4.325,0; S4 4.325,0 | hole 0.6: -2.89,3.68; 2.89,3.68
JST_SM06B-GHS-TB(LF)(SN) = smd 0.6 x 1.7: 1 -3.125,1.875; 2 -1.875,1.875; 3 -0.625,1.875; 4 0.625,1.875; 5 1.875,1.875; 6 3.125,1.875 | smd 1 x 2.7: S1 -4.975,-1.325; S2 4.975,-1.325
JST-2-PTH-NS = drill 0.7 pad 1.6: 1 -1,0; 2 1,0
1X04_1MM_RA = smd 0.6 x 1.35: 1 -1.5,0; 2 -0.5,0; 3 0.5,0; 4 1.5,0 | smd 1.2 x 2: NC1 2.8,-3.675; NC2 -2.8,-3.675
IND_NR3015T2R2M = smd 0.8 x 2.7: 1 -1.1,0; 2 1.1,0
WS2812B-2020 = smd 1 x 1: 1 1.015,-0.65; 2 1.015,0.65; 3 -1.015,0.65; 4 -1.015,-0.65
SW_JS202011JCQN = smd 1.6 x 1: 1 -1.2,2.5; 2 -1.2,0; 3 -1.2,-2.5; 5 1.2,2.5; 6 1.2,0; 7 1.2,-2.5
XCVR_ESP32-C6-MINI-1-N4 = smd 0.8 x 0.4: 1 -5.9,4; 2 -5.9,3.2; 3 -5.9,2.4; 4 -5.9,1.6; 5 -5.9,0.8; 6 -5.9,0; 7 -5.9,-0.8; 8 -5.9,-1.6; 9 -5.9,-2.4; 10 -5.9,-3.2; 11 -5.9,-4; 25 5.9,-4; 26 5.9,-3.2; 27 5.9,-2.4; 28 5.9,-1.6; 29 5.9,-0.8; 30 5.9,0; 31 5.9,0.8; 32 5.9,1.6; 33 5.9,2.4; 34 5.9,3.2; 35 5.9,4 | smd 0.4 x 0.8: 12 -4.8,-4.9; 13 -4,-4.9; 14 -3.2,-4.9; 15 -2.4,-4.9; 16 -1.6,-4.9; 17 -0.8,-4.9; 18 0,-4.9; 19 0.8,-4.9; 20 1.6,-4.9; 21 2.4,-4.9; 22 3.2,-4.9; 23 4,-4.9; 24 4.8,-4.9; 36 4.8,4.9; 37 4,4.9; 38 3.2,4.9; 39 2.4,4.9; 40 1.6,4.9; 41 0.8,4.9; 42 0,4.9; 43 -0.8,4.9; 44 -1.6,4.9; 45 -2.4,4.9; 46 -3.2,4.9; 47 -4,4.9; 48 -4.8,4.9 | smd 0.4 x 0.4: 49_1 -1.975,1.975 | smd 1.45 x 1.45: 49_2 0,1.975; 49_3 1.975,1.975; 49_4 -1.975,0; 49_5 0,0; 49_6 1.975,0; 49_7 -1.975,-1.975; 49_8 0,-1.975; 49_9 1.975,-1.975 | smd 0.7 x 0.7: 50 5.95,4.95; 51 5.95,-4.95; 52 -5.95,-4.95; 53 -5.95,4.95
IC_BME688 = smd 0.4 x 0.4: 1 1.2,1.2; 2 1.2,0.4; 3 1.2,-0.4; 4 1.2,-1.2; 5 -1.2,-1.2; 6 -1.2,-0.4; 7 -1.2,0.4; 8 -1.2,1.2
VREG_V62/16624-01YE = smd 0.6 x 0.24: 1 -1.4,1; 2 -1.4,0.5; 3 -1.4,0; 4 -1.4,-0.5; 5 -1.4,-1; 6 1.4,-1; 7 1.4,-0.5; 8 1.4,0; 9 1.4,0.5; 10 1.4,1 | smd 1.65 x 2.4: 11 0,0 | drill 0.2 pad 0.3: 12 0,-0.95; 13 -0.575,0; 14 0.575,0; 15 0,0.95
SOT65P210X110-6N = smd 1.19 x 0.4: 1 -0.96,0.65; 2 -0.96,0; 3 -0.96,-0.65; 4 0.96,-0.65; 5 0.96,0; 6 0.96,0.65
SON127P600X800X95-8N = smd 1.21 x 0.62: 1 -3.745,1.905; 2 -3.745,0.635; 3 -3.745,-0.635; 4 -3.745,-1.905; 5 3.745,-1.905; 6 3.745,-0.635; 7 3.745,0.635; 8 3.745,1.905
SOIC127P600X175-8N = smd 1.702 x 0.533: 1 -2.591,1.905; 2 -2.591,0.635; 3 -2.591,-0.635; 4 -2.591,-1.905; 5 2.591,-1.905; 6 2.591,-0.635; 7 2.591,0.635; 8 2.591,1.905
SOT95P280X145-5N = smd 1.27 x 0.559: 1 -1.295,0.94; 2 -1.295,0; 3 -1.295,-0.94; 4 1.295,-0.94; 5 1.295,0.94
XTAL_FC-135_32.7680KA-A0 = smd 1 x 1.8: 1 -1.25,0; 2 1.25,0

### Placement (x,y rotation side)
BOOT  35.08,43.25 180 top
C1  14.17,38.14 90 top
C2  15.65,37.86 90 top
C3  15.52,34.1 270 top
C4  15.75,43.42 90 top
C5  12.52,20.46 180 top
C6  12.5,17.97 180 top
C7  25.63,26.99 90 top
C8  21.18,26.99 90 top
C9  17.53,3.83 90 top
C10  12.6,3.83 90 top
C11  14,14.47 90 top
C12  12.55,14.47 90 top
C13  10.46,9.36 0 top
C14  17.25,10.66 180 top
C15  31.34,12.49 0 top
C16  39.14,25.92 90 top
C17  31.37,14.29 0 top
C18  31.65,6.59 0 top
C19  7.54,26.41 90 top
C20  31.7,9.41 0 top
C21  38.99,8.37 270 top
C22  38.61,12.77 180 top
C23  33.96,31.97 0 top
C24  31.65,24.07 0 top
C25  21.44,21.91 90 top
D2  43.71,32.81 0 top
D3  10.92,23.16 270 top
IC1  35.64,7.69 0 top
J1  5.11,33.59 270 top
J2  23.57,3.37 0 top
J3  43.51,15.89 90 top
J4  4.72,23.03 90 bottom
J5  41.43,26.99 90 top
L1  15.09,4.31 180 top
L2  9.93,11.83 270 top
LED1  32.03,26.08 0 top
R1  12.47,34.1 90 top
R2  14,34.1 270 top
R4  24.16,26.99 270 top
R5  22.63,26.99 270 top
R6  27.08,26.97 270 top
R7  30.07,4.92 180 top
R8  16.66,1.74 0 top
R9  31.67,8.02 180 top
R10  17.25,9.24 180 top
R11  38.71,16.75 180 top
R12  38.71,15.36 180 top
R13  43.41,34.2 180 top
R14  9.45,18.41 90 top
R15  12.32,22.83 270 top
RESET  12.34,43.25 0 top
S1  4.65,14.82 0 top
U1  23.57,34.86 0 top
U2  34.54,12.97 0 top
U3  14.02,10.91 0 top
U4  16.31,6.82 0 top
U5  12.17,6.8 0 top
U6  36.45,36.31 180 top
U7  20.29,17.92 0 top
U$1  8.48,22.72 270 top
Y1  15.24,19.19 90 top

### Tracks (layer width: path | path; a pad name or v marks a point on that pad's centre or on a via)
3.3V  (via drill 0.25, 0.38)
  Top 0.254: 12.62,12.36 12.62,13.82 C12.1 C11.1 15.03,13.89 v15.06,13.86 15.42,13.5 U3.10 | R1.2 11.35,34.68 v11.28,34.61 | C1.1 13.19,37.29 v13,37.48 | C17.2 31.92,14.27 C15.2 32.01,12.57 U2.6 | C17.2 33.22,14.29 U2.8 | C17.2 31.95,15.44 v31.83,15.56 | U2.2 v36.57,13.37 v36.58,13.38 | R12.2 R11.2 38.13,17.72 v38.25,17.85 | LED1.4 31.01,24.12 C24.1 30.12,24.07 v29.97,23.92 | IC1.10 33.87,8.69 33.66,8.91 33.66,8.96 33.46,9.15 v33.46,9.25 33.3,9.41 C20.2 | IC1.12 v33.6,6.69 32.32,6.69 C18.2 | R9.2 30.02,8.02 v30,7.99 | IC1.5 38.88,7.69 C21.2 39.88,7.79 v40.11,8.02
  Top 0.305: U3.1 12.62,12.36 | J1.1 4.47,36.13 v5.23,36.9 | U1.3 15.66,37.26 C2.1 C1.1 | R6.2 27.08,25.34 v27.13,25.29 | U7.8 21.54,19.83 21.39,19.98 21.39,21.28 C25.1 20.8,21.33 v20.47,21.66 | U6.8 34.11,34.41 34.54,33.98 C23.2 35.56,31.97 v35.71,31.82 | C16.2 41.41,26.5 J5.2 42.71,26.49 v42.9,26.3
  Route15 0.305: v5.23,36.9 5.23,38.17
  pour Route15: -1.12,-6.28 -1.12,52.14 50.95,52.14 50.95,-6.28
!BOOT  (via drill 0.38)
  Top 0.305: BOOT.3 v34.44,42.45 BOOT.4 | U1.23 27.57,31.12 v27.76,31.31
  Route2 0.305: v27.76,31.31 27.76,36.01 28.14,36.39 34.52,36.39 34.9,36.77 34.9,41.99 v34.44,42.45
!CS  (via drill 0.25)
  Top 0.254: U1.20 25.17,30.75 v25.25,30.83 | U6.2 39.32,35.68 39.07,35.42 v39.07,31.05
  Bottom 0.254: v25.25,30.83 27.25,30.83 27.47,30.61 38.62,30.61 v39.07,31.05
!INT_RTC
  Top 0.305: U7.3 19.1,17.29 19.57,17.76 U1.13
!RESET
  Top 0.254: R2.1 14,35.47 13.59,35.88 12.37,35.88 11.89,36.36 11.89,43.6 11.94,43.65 | RESET.3 15.71,44.05 C4.2
  Top 0.305: 11.54,44.05 RESET.4 | 11.94,43.65 11.54,44.05 | 11.54,44.05 RESET.3 14.42,44.02
!RST_ZMOD4510  (via drill 0.25)
  Top 0.254: IC1.11 33.73,7.69 v33.4,8.02 R9.1 | v27.05,33.26 U1.28 | U1.28
  Route2 0.254: v33.4,8.02 31.72,8.02 31.47,8.27 31.47,14.14 30.99,14.62 30.99,28.51 30.63,28.87 26.87,28.87 26.72,29.02 26.72,32.93 v27.05,33.26
EN
  Top 0.254: U1.8 16.84,33.26 16.58,33.52 C3.2
  Top 0.305: 17.66,33.25 U1.8 | J1.10 9.14,31.05 9.55,31.46 9.55,32.86 10.22,33.52 R1.1
  Top 0.406: R1.1 R2.2 C3.2
GND  (via drill 0.25)
  Top 0.254: U3.3 U3.13
  Top 0.305: J2.S1 19.83,8.12 J2.A1_B12 | J2.S2 27.32,8.12 J2.B1_A12
  other vias: 25.4,28.67 41,21.1
  pour Top: -5.44,-1.2 -5.44,53.41 49.43,53.41 49.43,-1.2
  pour Bottom: -1.12,-5.01 -1.12,49.6 53.49,49.6 53.49,-5.01
  pour Route2: -1.12,-6.28 -1.12,53.41 48.41,53.41 48.41,-6.28
INT_ZMOD4510  (via drill 0.25)
  Top 0.254: IC1.3 36.74,5.78 v36.93,5.78 | U1.27 28.69,32.46 v28.43,32.2
  Route2 0.254: v36.93,5.78 36.93,10.02 37.29,10.38 37.31,10.38 37.72,10.79 37.72,12.18 37.78,12.25 37.78,14.68 37.52,14.95 37.52,22.52 37.57,22.57 37.57,31.92 37.01,32.48 28.71,32.48 v28.43,32.2
MISO
  Top 0.254: U1.25 30.87,30.86 31.32,31.31 31.32,36.69 31.57,36.95 U6.6
MOSI
  Top 0.254: U1.26 30.51,31.66 30.84,31.99 30.84,37.94 31.12,38.22 U6.5
N$1
  Top 0.305: R5.1 22.63,28.82 22.78,28.97 22.78,29.95 U1.17
N$2
  Top 0.305: R4.1 24.16,28.54 23.57,29.12 U1.18
N$3
  Top 0.305: R6.1 27.08,28.97 26.77,29.28 U1.22
N$4
  Top 0.254: R7.2 25.73,4.92 25.32,5.33 J2.B5
N$5
  Top 0.254: 22.34,8.1 J2.A5 22.32,2.14 22.26,2.09 21.92,1.74 R8.2
N$6
  Top 0.254: L2.1 9.93,11.95 10.34,11.55 12.12,11.55 12.2,11.47 12.57,11.47 U3.2
N$8
  Top 0.254: U7.1 15.86,19.83 Y1.2 13.12,20.44 C5.1
N$9
  Top 0.254: U3.4 12.11,10.41 11.79,10.73 10.85,10.73 10.74,10.63 10.03,10.63 L2.2
N$10
  Top 0.254: U3.7 15.67,10.66 C14.2 | C14.2 | R10.2 C14.2
  Top 0.305: U3.7 U3.8
  Top 0.406: 15.42,10.89 U3.7 U3.6
N$11  (via drill 0.25)
  Top 0.254: U1.29 28.64,34.06 v28.63,34.05 | v41.68,33.85 41.68,34.99 42.37,35.68 43.69,35.68 43.99,35.38 R13.1
  Bottom 0.254: v28.63,34.05 41.48,34.05 v41.68,33.85
N$12
  Top 0.254: D2.A R13.2
N$14
  Top 0.305: U$1.5 9.45,21.4 R14.2
N$15
  Top 0.305: U$1.1 9.44,24.03 D3.A
N$16
  Top 0.305: 10.85,22.2 D3.C 12.29,22.28 R15.2
NEOPIXEL  (via drill 0.25)
  Top 0.254: LED1.3 30.01,26.73 v29.97,26.69 | v24.23,30.98 24.37,30.84 U1.19
  Bottom 0.254: v29.97,26.69 27.48,26.69 27,27.17 27,28.84 27.03,28.87 27.03,29.1 26.72,29.4 24.71,29.4 24.23,29.88 v24.23,30.98
RTC_IN
  Top 0.254: U7.2 15.86,18.56 Y1.1 15.21,17.97 C6.1
SCK
  Top 0.254: U1.24 28.37,28.95 28.65,28.67 37.82,28.67 38.28,29.12 38.28,36.74 38.51,36.97 40.17,36.97 U6.3
SCL  (via drill 0.25, 0.38)
  Top 0.254: U2.4 36.71,11.77 v36.98,11.5 | v43.05,28.7 42.84,28.49 41.45,28.49 J5.4 38.61,28.49 37.9,27.78 37.9,22.6 38.53,21.96 38.56,21.96 39.29,21.23 R11.1 40.11,16.75 40.36,16.5 41.62,16.5 J3.4 43.19,16.52 v43.25,16.58 | v21.54,17.29 U7.6 | IC1.1 35.14,5.81 34.93,5.6 34.32,5.6 v34.14,5.78
  Top 0.305: U1.5 18.94,35.66 v19,35.6
  Bottom 0.254: v43.05,28.7 43.05,27.05 43.54,26.57 43.54,26.04 43.15,25.65 43.15,16.68 v43.25,16.58 43.25,11.42 42.65,10.81 39.56,10.81 39.46,10.71 38.74,10.71 37.95,11.5 v36.98,11.5 34.57,11.5 | v21.54,17.29 21.29,17.03 21.29,11.73 21.51,11.5 34.57,11.5 | v34.14,5.78 34.8,5.78 35.1,6.09 35.1,10.96 34.57,11.5
  Bottom 0.305: v19,35.6 42.65,35.6 43.05,35.19 v43.05,28.7
SDA  (via drill 0.25, 0.38)
  Top 0.254: J5.3 43.28,27.49 v43.79,28.01 43.78,27.99 43.78,23.85 43.16,23.23 43.16,20.23 43.89,19.5 43.89,15.69 43.47,15.27 J3.3 41.54,15.36 R12.1 39.29,14.62 38.68,14.01 37.75,14.01 37.21,13.48 37.21,13.11 36.67,12.57 | U2.3 36.67,12.57 | U7.5 23.72,16.02 v24.28,16.58 | v37.14,12.51 36.73,12.51 36.67,12.57 | IC1.2 35.64,5.63 v35.89,5.38
  Top 0.305: v19.89,34.87 U1.6
  Route2 0.254: v37.14,12.51 37.04,12.61 35.89,12.61 35.65,12.37 35.64,12.36 35.61,12.33 35.61,5.65 v35.89,5.38
  Bottom 0.254: v43.79,28.01 43.71,28.08 | v24.28,16.58 24.28,13.12 24.89,12.51 v37.14,12.51
  Bottom 0.305: v19.89,34.87 19.88,34.86 17.5,34.86 17.27,35.09 17.27,35.78 17.82,36.33 43.14,36.33 43.71,35.75 43.71,28.08
TCK  (via drill 0.38)
  Top 0.305: U1.15 21.17,30.99 v21.16,31 | v4.93,34.86 J1.4
  Bottom 0.305: v21.16,31 21.16,29.91 20.93,29.68 9.5,29.68 9.12,30.06 9.12,34.53 8.79,34.86 v4.93,34.86
TDI  (via drill 0.38)
  Top 0.305: J1.8 5.66,32.32 5.44,32.1 5.44,30.17 v5.92,29.68 | U1.10 18.36,31.66 v18.85,31.18
  Route2 0.305: v5.92,29.68 18.52,29.68 18.85,30.01 v18.85,31.18
TDO  (via drill 0.38)
  Top 0.305: U1.16 21.97,30.73 v22.3,31.05 | J1.6 v5.18,33.59
  Route2 0.305: v22.3,31.05 22.3,31.62 21.97,31.94 5.28,31.94 4.93,32.3 4.93,33.34 v5.18,33.59
TMS  (via drill 0.38)
  Top 0.305: U1.9 18.58,32.46 v19.2,33.09 | v9.3,36.11 7.01,36.11 J1.2
  Route2 0.305: v19.2,33.09 19.2,34.38 18.75,34.84 12.27,34.84 11.86,35.25 11.86,35.63 11.38,36.11 v9.3,36.11
USB_N
  Top 0.254: R5.2 22.63,26.23 22.63,24.81 23.04,24.4 23.04,21.8 23.49,21.35 24.97,21.35 26.21,20.11 26.21,10.91 25.86,10.56 23.39,10.56 22.82,9.99 J2.B7 22.82,6.86 22.96,6.72 23.67,6.72 23.82,6.87 J2.A7
  Top 0.305: 21.29,26.52 C8.1 22.45,26.41 22.63,26.23
USB_P
  Top 0.254: J2.A6 23.32,9.95 23.55,10.18 24.71,10.18 | 26.48,10.64 26.02,10.18 24.71,10.18 | 26.48,10.64 | 26.48,10.64 26.59,10.75 26.59,20.26 26.48,20.38 | 26.48,20.38 | R4.2 24.16,25.14 23.42,24.4 23.42,21.96 23.65,21.73 25.13,21.73 26.48,20.38 | J2.B6 24.32,9.78 24.71,10.18
  Top 0.305: 24.27,26.03 R4.2 C7.1
V_BATT
  Top 0.305: J4.2 7.53,24.03 U$1.3 C19.1
  Top 0.406: S1.2 2.11,14.82 1.75,15.18 1.75,22.88 2.91,24.03 J4.2
V_USB_2  (via drill 0.25)
  Top 0.254: L1.2 14.14,4.41 C10.2 v10.49,4.41 10.11,4.79 10.11,5.93 10.32,6.15 U5.3 | 15.84,7.47 U4.1 15.96,7.47 v16.31,7.82 | J3.1 C22.1 v39.19,11.34
  Top 0.305: 12.61,4.66 C10.2 | U$1.4 7.54,19.37 v7.49,19.32
  Route15 0.254: 16.18,5.32 16.18,7.81 v16.3,7.81 v16.31,7.82 | 16.18,5.32 16.18,4.94 15.54,4.31 10.59,4.31 v10.49,4.41 | v39.19,11.34 39.19,11.27 38.79,10.86 38.61,10.86 38.2,10.46 38.2,5.6 37.74,5.15 36.56,5.15 36.15,4.74 35.63,4.74 35.62,4.74 16.76,4.74 16.18,5.32
  Route15 0.305: 16.18,7.81 16.18,14.14 15.77,14.54 8,14.54 7.49,15.05 v7.49,19.32
VBUS_PREFILTER  (via drill 0.38)
  Top 0.254: J2.A4_B9 21.17,7.45 21.31,7.31 21.31,4.76 20.96,4.41 20.35,4.41 20.04,4.71 18.75,4.71 18.39,4.36 17.65,4.36 17.53,4.48 | C9.2 17.43,4.31 L1.1
  Top 0.305: J2.B4_A9 25.97,8.92 v26.57,9.52 | J2.A4_B9 21.17,9.32 v21.16,9.34 | 17.54,4.66 17.53,4.48 C9.2
  Route15 0.305: v26.57,9.52 21.34,9.52 v21.16,9.34
VIN  (via drill 0.25)
  Top 0.254: U5.1 v9.04,7.45 8.32,7.45 7.95,7.81 7.95,10.79 7.7,11.04 6.99,11.04 | U4.3 15.34,6.16 v14.33,6.16
  Top 0.305: S1.3 3.45,11.27 3.68,11.04 6.99,11.04
  Route15 0.254: v9.04,7.45 14.08,7.45 14.35,7.18 14.35,6.19 v14.33,6.16
VREF1
  Top 0.254: U3.5 12.62,9.54 12.43,9.34 | 12.43,9.34 11.06,9.34 | U5.6 14.04,7.45 14.25,7.66 14.25,8.32 13.89,8.68 | 13.89,8.68 13.03,8.68 12.43,9.28 12.43,9.34 | U4.6 17.29,7.47 17.78,7.97 | 17.78,7.97 17.83,8.02 R10.1 | 13.89,8.68 15.89,8.68 16.11,8.46 17.29,8.46 17.78,7.97
  Top 0.406: 11.17,9.22 11.06,9.34 C13.2

### Text on the board
tNames: Qwiic | PM Sensor